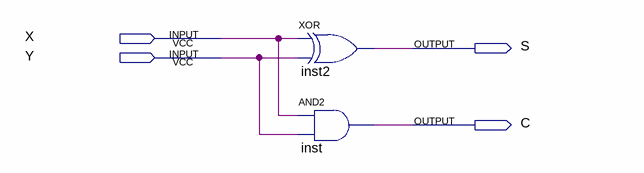
[diagram p0: schematic sheet]
// Quartus schematic Meio_Somador.bdf as structural Verilog: 2 symbols, 4 pins
module Meio_Somador (
  input  X,
  input  Y,
  output S,
  output C
);

  xor inst2 (S, X, Y);
  and inst (C, X, Y);
endmodule
